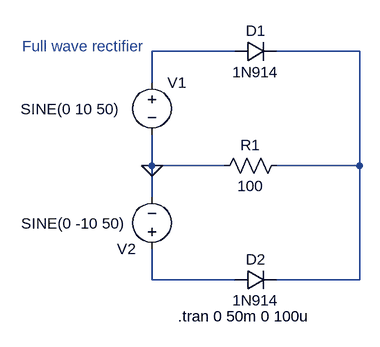
[diagram p0: schematic fullonda.asc]
fullonda.asc, the LTspice schematic file:
Version 4
SHEET 1 880 680
WIRE -272 240 -400 240
WIRE -80 240 -208 240
WIRE -400 288 -400 240
WIRE -400 416 -400 368
WIRE -288 416 -400 416
WIRE -80 416 -80 240
WIRE -80 416 -208 416
WIRE -400 464 -400 416
WIRE -400 592 -400 544
WIRE -272 592 -400 592
WIRE -80 592 -80 416
WIRE -80 592 -208 592
FLAG -400 416 0
SYMBOL diode -272 256 R270
WINDOW 0 32 32 VTop 2
WINDOW 3 0 32 VBottom 2
SYMATTR InstName D1
SYMATTR Value 1N914
SYMBOL voltage -400 272 R0
WINDOW 3 -202 57 Left 2
WINDOW 123 0 0 Left 2
WINDOW 39 0 0 Left 2
SYMATTR Value SINE(0 10 50)
SYMATTR InstName V1
SYMBOL res -304 432 R270
WINDOW 0 32 56 VTop 2
WINDOW 3 0 56 VBottom 2
SYMATTR InstName R1
SYMATTR Value 100
SYMBOL voltage -400 560 R180
WINDOW 3 40 55 Left 2
WINDOW 123 0 0 Left 2
WINDOW 39 0 0 Left 2
SYMATTR Value SINE(0 -10 50)
SYMATTR InstName V2
SYMBOL diode -272 608 R270
WINDOW 0 32 32 VTop 2
WINDOW 3 0 32 VBottom 2
SYMATTR InstName D2
SYMATTR Value 1N914
TEXT -360 648 Left 2 !.tran 0 50m 0 100u
TEXT -600 232 Left 2 ;Full wave rectifier

The netlist it stands for:
* fullonda.asc
D1 N001 N002 1N914
V1 N001 0 SINE(0 10 50)
R1 0 N002 100
V2 N003 0 SINE(0 -10 50)
D2 N003 N002 1N914
.model D D
.lib standard.dio
.tran 0 50m 0 100u
* Full wave rectifier
.backanno
.end